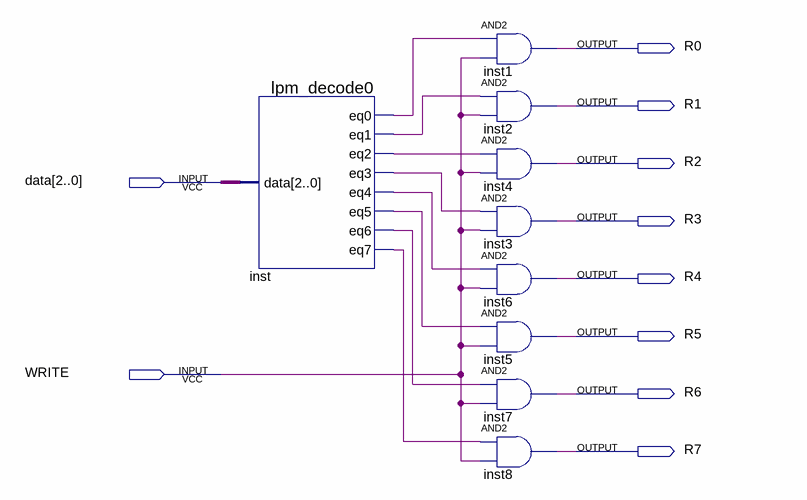
[diagram p0: schematic sheet]
// Quartus schematic RW_REG.bdf as structural Verilog: 9 symbols, 10 pins
module RW_REG (
  input  [2:0] data,
  input  WRITE,
  output R0,
  output R1,
  output R2,
  output R3,
  output R4,
  output R5,
  output R6,
  output R7
);

  wire inst_eq0, inst_eq1, inst_eq2, inst_eq3, inst_eq4, inst_eq5, inst_eq6, inst_eq7;

  lpm_decode0 inst (
    .data(data), .eq0(inst_eq0), .eq1(inst_eq1), .eq2(inst_eq2), .eq3(inst_eq3), .eq4(inst_eq4),
    .eq5(inst_eq5), .eq6(inst_eq6), .eq7(inst_eq7));
  and inst1 (R0, inst_eq0, WRITE);
  and inst2 (R1, inst_eq1, WRITE);
  and inst4 (R2, inst_eq2, WRITE);
  and inst3 (R3, inst_eq3, WRITE);
  and inst6 (R4, inst_eq4, WRITE);
  and inst5 (R5, inst_eq5, WRITE);
  and inst7 (R6, inst_eq6, WRITE);
  and inst8 (R7, inst_eq7, WRITE);
endmodule
